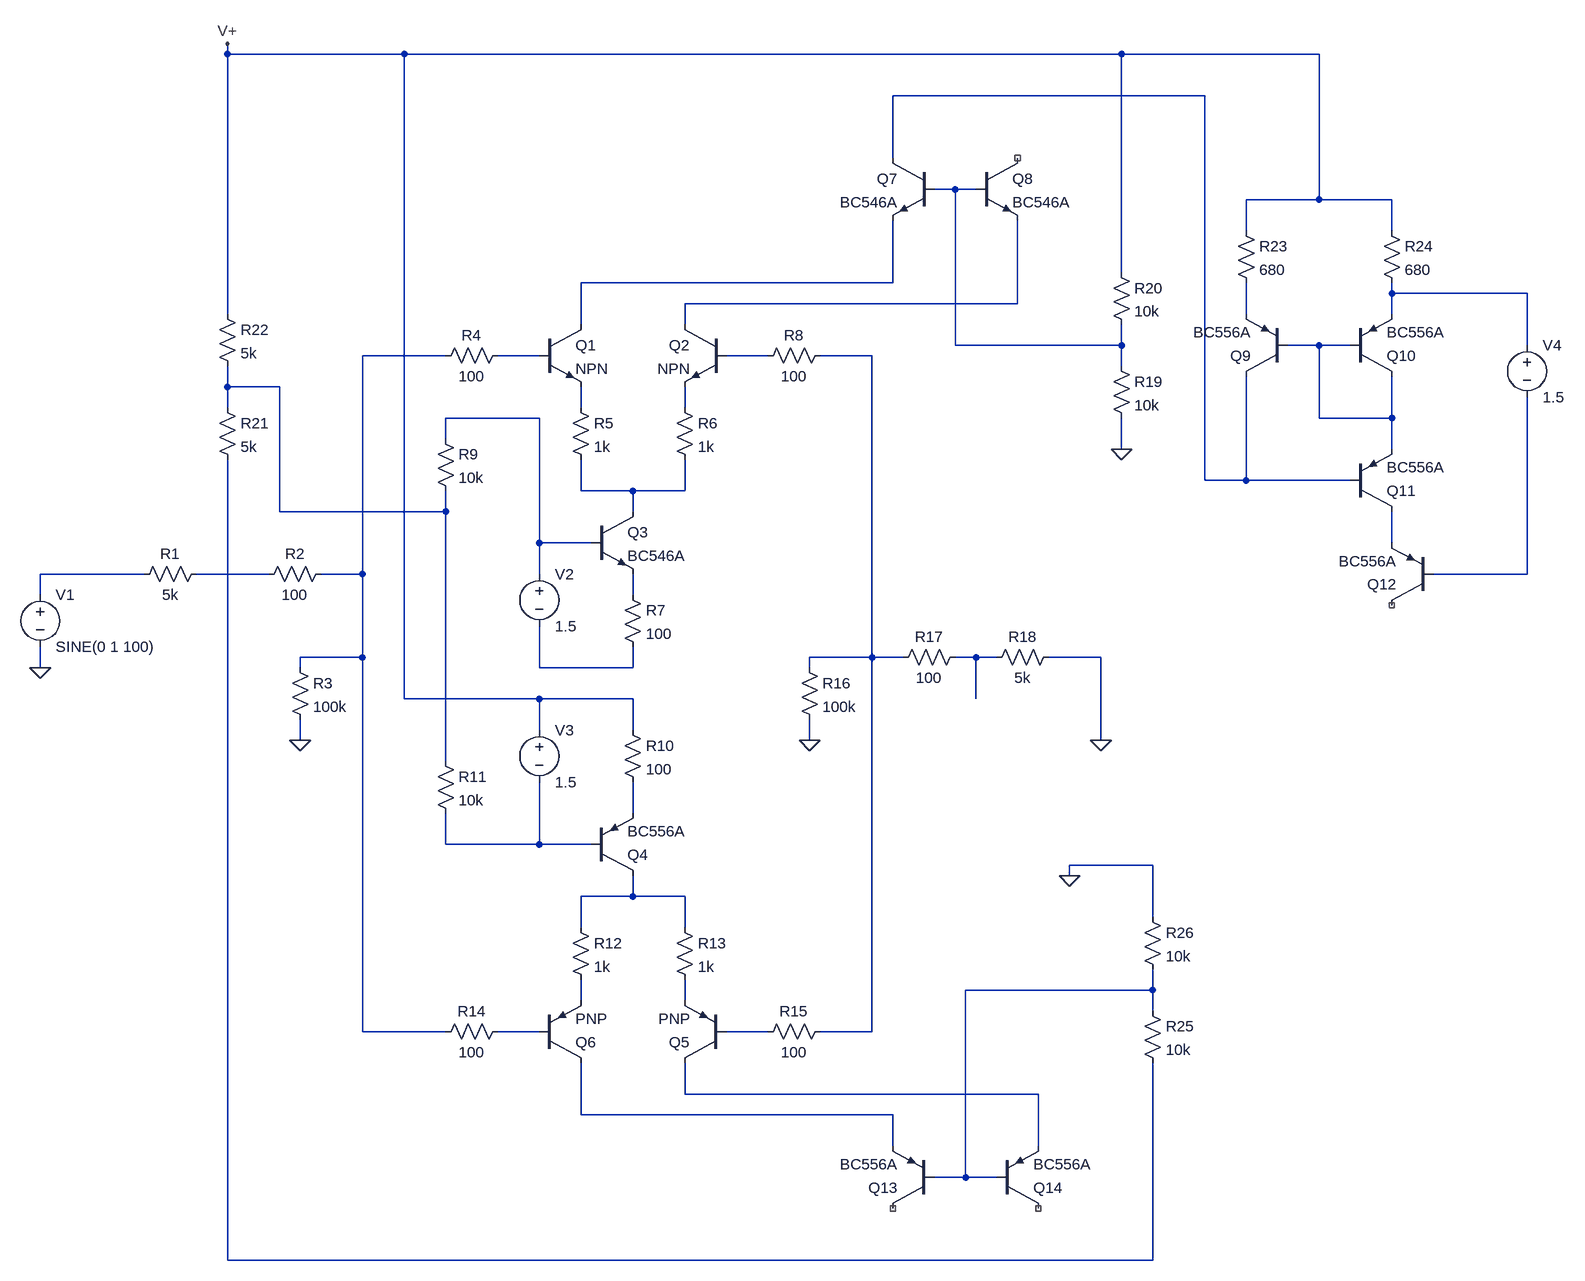
[diagram p0: schematic CFA3_Input.asc]
CFA3_Input.asc, the LTspice schematic file:
Version 4
SHEET 1 2400 1156
WIRE 336 -704 336 -720
WIRE 608 -704 336 -704
WIRE 1712 -704 608 -704
WIRE 2016 -704 1712 -704
WIRE 1840 -640 1360 -640
WIRE 1360 -544 1360 -640
WIRE 1456 -496 1424 -496
WIRE 1488 -496 1456 -496
WIRE 2016 -480 2016 -704
WIRE 2016 -480 1904 -480
WIRE 2128 -480 2016 -480
WIRE 1904 -432 1904 -480
WIRE 2128 -432 2128 -480
WIRE 1712 -368 1712 -704
WIRE 1360 -352 1360 -448
WIRE 1360 -352 880 -352
WIRE 2128 -336 2128 -352
WIRE 2336 -336 2128 -336
WIRE 1552 -320 1552 -448
WIRE 1552 -320 1040 -320
WIRE 336 -304 336 -704
WIRE 1904 -304 1904 -352
WIRE 2128 -304 2128 -336
WIRE 880 -288 880 -352
WIRE 1040 -288 1040 -320
WIRE 1456 -256 1456 -496
WIRE 1712 -256 1712 -288
WIRE 1712 -256 1456 -256
WIRE 2016 -256 1968 -256
WIRE 2064 -256 2016 -256
WIRE 2336 -256 2336 -336
WIRE 672 -240 544 -240
WIRE 816 -240 752 -240
WIRE 1168 -240 1104 -240
WIRE 1328 -240 1248 -240
WIRE 1712 -224 1712 -256
WIRE 336 -192 336 -224
WIRE 416 -192 336 -192
WIRE 336 -160 336 -192
WIRE 880 -160 880 -192
WIRE 1040 -160 1040 -192
WIRE 816 -144 672 -144
WIRE 2016 -144 2016 -256
WIRE 2128 -144 2128 -208
WIRE 2128 -144 2016 -144
WIRE 672 -112 672 -144
WIRE 1712 -96 1712 -144
WIRE 2128 -96 2128 -144
WIRE 1840 -48 1840 -640
WIRE 1904 -48 1904 -208
WIRE 1904 -48 1840 -48
WIRE 2064 -48 1904 -48
WIRE 880 -32 880 -80
WIRE 960 -32 880 -32
WIRE 1040 -32 1040 -80
WIRE 1040 -32 960 -32
WIRE 416 0 416 -192
WIRE 672 0 672 -32
WIRE 672 0 416 0
WIRE 960 0 960 -32
WIRE 816 48 816 -144
WIRE 896 48 816 48
WIRE 2128 48 2128 0
WIRE 208 96 48 96
WIRE 400 96 288 96
WIRE 544 96 544 -240
WIRE 544 96 480 96
WIRE 816 96 816 48
WIRE 2336 96 2336 -176
WIRE 2336 96 2192 96
WIRE 48 128 48 96
WIRE 960 128 960 96
WIRE 544 224 544 96
WIRE 544 224 448 224
WIRE 1328 224 1328 -240
WIRE 1328 224 1232 224
WIRE 1376 224 1328 224
WIRE 1488 224 1456 224
WIRE 1520 224 1488 224
WIRE 1680 224 1600 224
WIRE 48 240 48 208
WIRE 448 240 448 224
WIRE 816 240 816 176
WIRE 960 240 960 208
WIRE 960 240 816 240
WIRE 1232 240 1232 224
WIRE 608 288 608 -704
WIRE 816 288 608 288
WIRE 960 288 816 288
WIRE 1488 288 1488 224
WIRE 816 336 816 288
WIRE 960 336 960 288
WIRE 448 352 448 320
WIRE 1232 352 1232 320
WIRE 1680 352 1680 224
WIRE 672 384 672 0
WIRE 960 464 960 416
WIRE 672 512 672 464
WIRE 816 512 816 416
WIRE 816 512 672 512
WIRE 896 512 816 512
WIRE 1760 544 1632 544
WIRE 1632 560 1632 544
WIRE 960 592 960 560
WIRE 960 592 880 592
WIRE 1040 592 960 592
WIRE 1760 624 1760 544
WIRE 880 640 880 592
WIRE 1040 640 1040 592
WIRE 1760 736 1760 704
WIRE 1760 736 1472 736
WIRE 880 752 880 720
WIRE 1040 752 1040 720
WIRE 1760 768 1760 736
WIRE 544 800 544 224
WIRE 672 800 544 800
WIRE 816 800 752 800
WIRE 1168 800 1104 800
WIRE 1328 800 1328 224
WIRE 1328 800 1248 800
WIRE 1040 896 1040 848
WIRE 1584 896 1040 896
WIRE 880 928 880 848
WIRE 1360 928 880 928
WIRE 1360 976 1360 928
WIRE 1584 976 1584 896
WIRE 1472 1024 1472 736
WIRE 1472 1024 1424 1024
WIRE 1520 1024 1472 1024
WIRE 336 1152 336 -80
WIRE 1760 1152 1760 848
WIRE 1760 1152 336 1152
FLAG 48 240 0
FLAG 448 352 0
FLAG 1232 352 0
FLAG 1680 352 0
FLAG 1712 -96 0
FLAG 336 -720 V+
FLAG 1632 560 0
SYMBOL voltage 48 112 R0
WINDOW 123 0 0 Left 0
WINDOW 39 0 0 Left 0
SYMATTR InstName V1
SYMATTR Value SINE(0 1 100)
SYMBOL res 304 80 R90
WINDOW 0 0 56 VBottom 2
WINDOW 3 32 56 VTop 2
SYMATTR InstName R1
SYMATTR Value 5k
SYMBOL res 496 80 R90
WINDOW 0 0 56 VBottom 2
WINDOW 3 32 56 VTop 2
SYMATTR InstName R2
SYMATTR Value 100
SYMBOL res 432 224 R0
SYMATTR InstName R3
SYMATTR Value 100k
SYMBOL res 768 -256 R90
WINDOW 0 0 56 VBottom 2
WINDOW 3 32 56 VTop 2
SYMATTR InstName R4
SYMATTR Value 100
SYMBOL npn 816 -288 R0
SYMATTR InstName Q1
SYMBOL npn 1104 -288 M0
SYMATTR InstName Q2
SYMBOL res 864 -176 R0
SYMATTR InstName R5
SYMATTR Value 1k
SYMBOL res 1024 -176 R0
SYMATTR InstName R6
SYMATTR Value 1k
SYMBOL npn 896 0 R0
SYMATTR InstName Q3
SYMATTR Value BC546A
SYMBOL res 944 112 R0
SYMATTR InstName R7
SYMATTR Value 100
SYMBOL voltage 816 80 R0
WINDOW 123 0 0 Left 0
WINDOW 39 0 0 Left 0
SYMATTR InstName V2
SYMATTR Value 1.5
SYMBOL res 1264 -256 R90
WINDOW 0 0 56 VBottom 2
WINDOW 3 32 56 VTop 2
SYMATTR InstName R8
SYMATTR Value 100
SYMBOL res 656 -128 R0
SYMATTR InstName R9
SYMATTR Value 10k
SYMBOL voltage 816 320 R0
WINDOW 123 0 0 Left 0
WINDOW 39 0 0 Left 0
SYMATTR InstName V3
SYMATTR Value 1.5
SYMBOL res 944 320 R0
SYMATTR InstName R10
SYMATTR Value 100
SYMBOL pnp 896 560 M180
SYMATTR InstName Q4
SYMATTR Value BC556A
SYMBOL res 656 368 R0
SYMATTR InstName R11
SYMATTR Value 10k
SYMBOL res 864 624 R0
SYMATTR InstName R12
SYMATTR Value 1k
SYMBOL res 1024 624 R0
SYMATTR InstName R13
SYMATTR Value 1k
SYMBOL pnp 1104 848 R180
SYMATTR InstName Q5
SYMBOL pnp 816 848 M180
SYMATTR InstName Q6
SYMBOL res 768 784 R90
WINDOW 0 0 56 VBottom 2
WINDOW 3 32 56 VTop 2
SYMATTR InstName R14
SYMATTR Value 100
SYMBOL res 1264 784 R90
WINDOW 0 0 56 VBottom 2
WINDOW 3 32 56 VTop 2
SYMATTR InstName R15
SYMATTR Value 100
SYMBOL res 1216 224 R0
SYMATTR InstName R16
SYMATTR Value 100k
SYMBOL res 1472 208 R90
WINDOW 0 0 56 VBottom 2
WINDOW 3 32 56 VTop 2
SYMATTR InstName R17
SYMATTR Value 100
SYMBOL res 1616 208 R90
WINDOW 0 0 56 VBottom 2
WINDOW 3 32 56 VTop 2
SYMATTR InstName R18
SYMATTR Value 5k
SYMBOL npn 1424 -544 M0
SYMATTR InstName Q7
SYMATTR Value BC546A
SYMBOL npn 1488 -544 R0
SYMATTR InstName Q8
SYMATTR Value BC546A
SYMBOL res 1696 -240 R0
SYMATTR InstName R19
SYMATTR Value 10k
SYMBOL res 1696 -384 R0
SYMATTR InstName R20
SYMATTR Value 10k
SYMBOL res 320 -176 R0
SYMATTR InstName R21
SYMATTR Value 5k
SYMBOL res 320 -320 R0
SYMATTR InstName R22
SYMATTR Value 5k
SYMBOL res 1888 -448 R0
SYMATTR InstName R23
SYMATTR Value 680
SYMBOL res 2112 -448 R0
SYMATTR InstName R24
SYMATTR Value 680
SYMBOL pnp 1968 -208 R180
SYMATTR InstName Q9
SYMATTR Value BC556A
SYMBOL pnp 2064 -208 M180
SYMATTR InstName Q10
SYMATTR Value BC556A
SYMBOL pnp 2064 0 M180
SYMATTR InstName Q11
SYMATTR Value BC556A
SYMBOL voltage 2336 -272 R0
WINDOW 123 0 0 Left 0
WINDOW 39 0 0 Left 0
SYMATTR InstName V4
SYMATTR Value 1.5
SYMBOL pnp 2192 144 R180
SYMATTR InstName Q12
SYMATTR Value BC556A
SYMBOL pnp 1424 1072 R180
SYMATTR InstName Q13
SYMATTR Value BC556A
SYMBOL pnp 1520 1072 M180
SYMATTR InstName Q14
SYMATTR Value BC556A
SYMBOL res 1744 608 R0
SYMATTR InstName R26
SYMATTR Value 10k
SYMBOL res 1744 752 R0
SYMATTR InstName R25
SYMATTR Value 10k

The netlist it stands for:
* CFA3_Input.asc
V1 N018 0 SINE(0 1 100)
R1 N019 N018 5k
R2 N008 N019 100
R3 N008 0 100k
R4 N009 N008 100
Q1 N003 N009 N013 0 NPN
Q2 N005 N010 N014 0 NPN
R5 N013 N016 1k
R6 N014 N016 1k
Q3 N016 N015 N021 0 BC546A
R7 N021 N023 100
V2 N015 N023 1.5
R8 N011 N010 100
R9 N015 N012 10k
V3 V+ N025 1.5
R10 V+ N024 100
Q4 N026 N025 N024 0 BC556A
R11 N012 N025 10k
R12 N026 N028 1k
R13 N026 N029 1k
Q5 N032 N031 N029 0 PNP
Q6 N033 N030 N028 0 PNP
R14 N030 N008 100
R15 N011 N031 100
R16 N011 0 100k
R17 N022 N011 100
R18 0 N022 5k
Q7 N001 N002 N003 0 BC546A
Q8 NC_01 N002 N005 0 BC546A
R19 N002 0 10k
R20 V+ N002 10k
R21 N012 N034 5k
R22 V+ N012 5k
R23 V+ N006 680
R24 V+ N004 680
Q9 N001 N007 N006 0 BC556A
Q10 N007 N007 N004 0 BC556A
Q11 N017 N001 N007 0 BC556A
V4 N004 N020 1.5
Q12 NC_02 N020 N017 0 BC556A
Q13 NC_03 N027 N033 0 BC556A
Q14 NC_04 N027 N032 0 BC556A
R26 0 N027 10k
R25 N027 N034 10k
.model NPN NPN
.model PNP PNP
.lib standard.bjt
.backanno
.end